# EAGLE design FSAE Charger Control Board rev3 (EAGLE 9.0.1)
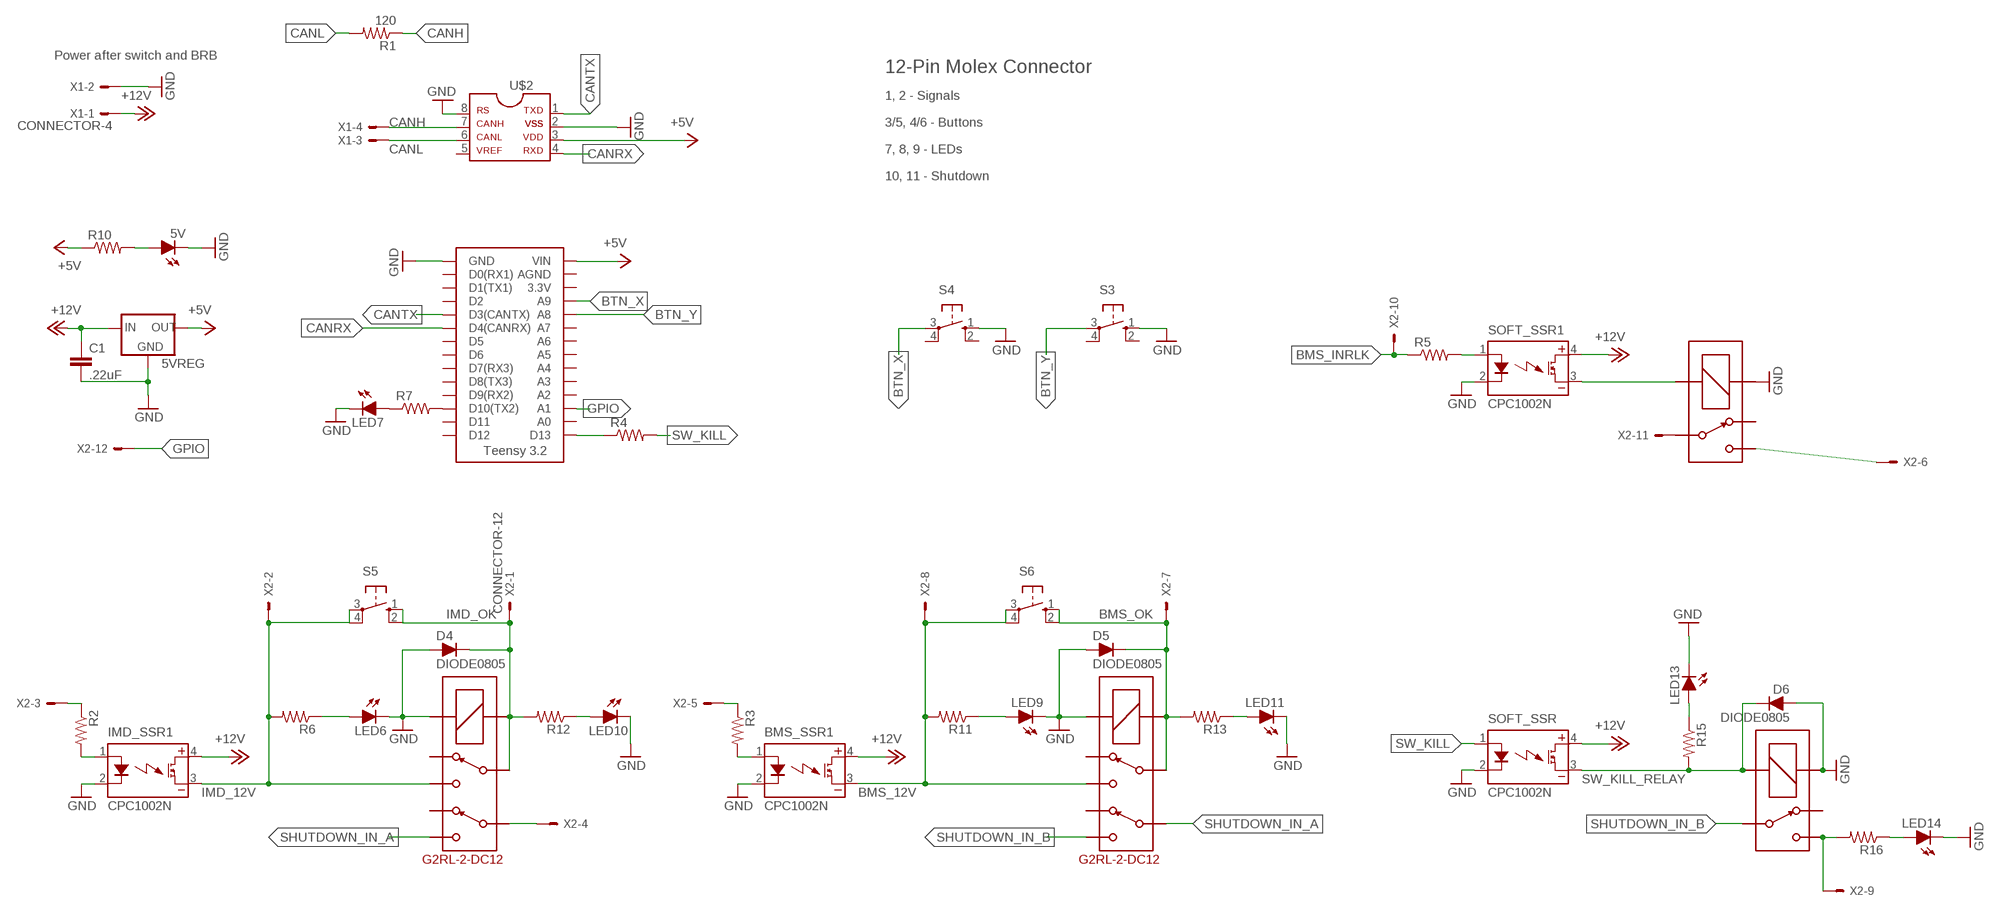
[diagram p0: schematic, sheet 1]

## Parts
5V  LED-0805  [LED-805]
5VREG  5VREG_LM340-NLM340MPX-5.0/NOPB  [SOT223]
BMS_SSR1  CPC1002N  [SOP04]
C1  .22uF  CAP0805  [0805]
D4  DIODE0805  [0805_D]
D5  DIODE0805  [0805_D]
D6  DIODE0805  [0805_D]
IMD_SSR1  CPC1002N  [SOP04]
LED6  LED-0805  [LED-805]
LED7  LED-0805  [LED-805]
LED9  LED-0805  [LED-805]
LED10  LED-0805  [LED-805]
LED11  LED-0805  [LED-805]
LED13  LED-0805  [LED-805]
LED14  LED-0805  [LED-805]
R1  120  RESISTOR0805-RES  [0805]
R2  RESISTOR0805-RES  [0805]
R3  RESISTOR0805-RES  [0805]
R4  RESISTOR0805-RES  [0805]
R5  RESISTOR0805-RES  [0805]
R6  RESISTOR0805-RES  [0805]
R7  RESISTOR0805-RES  [0805]
R10  RESISTOR0805-RES  [0805]
R11  RESISTOR0805-RES  [0805]
R12  RESISTOR0805-RES  [0805]
R13  RESISTOR0805-RES  [0805]
R15  RESISTOR0805-RES  [0805]
R16  RESISTOR0805-RES  [0805]
S3  BTN_10-XX  [B3F-10XX]
S4  BTN_10-XX  [B3F-10XX]
S5  BTN_10-XX  [B3F-10XX]
S6  BTN_10-XX  [B3F-10XX]
SOFT_SSR  CPC1002N  [SOP04]
SOFT_SSR1  CPC1002N  [SOP04]
U$1  TEENSY_3.2_SIMPLE  [TEENSY_3.2_SIMPLE]
U$2  MCP2551  [SOIC-08]
U$3  G5LE  [ZF112]
U$6  G2RL-2-DC12  [G2RL-2]
U$7  G2RL-2-DC12  [G2RL-2]
U$8  G5LE  [ZF112]
X1  CONNECTOR-4  [MINIFIT_5566-4]
X2  CONNECTOR-12  [MINIFIT_5566-12]

## Nets
+5V: 5VREG.3(OUT) R10.1 U$1.VIN U$2.3
+12V: 5VREG.1(IN) BMS_SSR1.4(DC+) C1.1 IMD_SSR1.4(DC+) SOFT_SSR1.4(DC+) SOFT_SSR.4(DC+) X1.1
BMS_12V: BMS_SSR1.3(DC-) R11.2 S6.3(P) S6.4(P1) U$7.4 X2.8
BMS_INRLK: R5.1 X2.10
BMS_OK: D5.C R13.2 S6.1(S) S6.2(S1) U$7.3 U$7.COIL- X2.7
BTN_X: S4.3(P) U$1.A9
BTN_Y: S3.3(P) U$1.A8
CANH: R1.1 U$2.7 X1.4
CANL: R1.2 U$2.6 X1.3
CANRX: U$1.D4(CANRX) U$2.4
CANTX: U$1.D3(CANTX) U$2.1
GND: 5V.C 5VREG.2(GND) 5VREG.4(GND) BMS_SSR1.2(CONTROL-) C1.2 D4.A D5.A D6.A IMD_SSR1.2(CONTROL-) LED6.C LED7.C LED9.C LED10.C LED11.C LED13.C LED14.C S3.1(S) S4.1(S) SOFT_SSR1.2(CONTROL-) SOFT_SSR.2(CONTROL-) U$1.GND U$2.2 U$2.8 U$3.1(COIL+) U$6.COIL+ U$7.COIL+ U$8.1(COIL+) X1.2
GPIO: U$1.A1 X2.12
IMD_12V: IMD_SSR1.3(DC-) R6.2 S5.3(P) S5.4(P1) U$6.4 X2.2
IMD_OK: D4.C R12.2 S5.1(S) S5.2(S1) U$6.3 U$6.COIL- X2.1
N$1: SOFT_SSR1.3(DC-) U$3.2(COIL-)
N$2: LED7.A R7.1
N$3: 5V.A R10.2
N$4: IMD_SSR1.1(CONTROL+) R2.2
N$5: U$3.S X2.6
N$6: LED6.A R6.1
N$7: LED9.A R11.1
N$8: LED10.A R12.1
N$9: U$3.P X2.11
N$10: R7.2 U$1.D10(TX2)
N$11: BMS_SSR1.1(CONTROL+) R3.2
N$12: LED11.A R13.1
N$13: LED14.A R16.1
N$14: LED13.A R15.1
N$15: R2.1 X2.3
N$16: R3.1 X2.5
N$17: R5.2 SOFT_SSR1.1(CONTROL+)
N$18: R4.1 U$1.D13
SHUTDOWN_IN: U$6.6 X2.4
SHUTDOWN_IN_A: U$6.5 U$7.6
SHUTDOWN_IN_B: U$7.5 U$8.P
SHUTDOWN_OUT: R16.2 U$8.S X2.9
SW_KILL: R4.2 SOFT_SSR.1(CONTROL+)
SW_KILL_RELAY: D6.C R15.2 SOFT_SSR.3(DC-) U$8.2(COIL-)
Unconnected: S3.2(S1) S3.4(P1) S4.2(S1) S4.4(P1) U$1.3.3V U$1.A0 U$1.A2 U$1.A3 U$1.A4 U$1.A5 U$1.A6 U$1.A7 U$1.AGND U$1.D0(RX1) U$1.D1(TX1) U$1.D2 U$1.D5 U$1.D6 U$1.D7(RX3) U$1.D8(TX3) U$1.D9(RX2) U$1.D11 U$1.D12 U$2.5 U$3.O U$6.2 U$6.7 U$7.2 U$7.7 U$8.O

## Notes on the sheet
- Power after switch and BRB
- 12-Pin Molex Connector
- 1, 2 - Signals
- 3/5, 4/6 - Buttons
- 7, 8, 9 - LEDs
- 10, 11 - Shutdown

## Library data of the parts
5V LED6 LED7 LED9-LED11 LED13 LED14 = HyTechDevices:LED: Light Emitting Diode (LED) Source: Dangerous Prototypes Eagle Library <https://github.com/DangerousPrototypes/Eagle_Part_Library>
5VREG = HyTechDevices:5VREG_LM340-N: Voltage Regulator 5v linear voltage regulator Datasheet <http://www.mouser.com/ProductDetail/Texas-Instruments/LM340MPX-50-NOPB/?qs=X1J7HmVL2ZGZwtTFRQ9ItA%3D%3D> MAX current out: 1.5A MAX voltage in: 35V
BMS_SSR1 IMD_SSR1 SOFT_SSR SOFT_SSR1 = HyTechDevices:CPC1002N: IXYS Solid State Relay .7A
C1 = HyTechDevices:CAP: Capacitor Standard 0603 ceramic capacitor, and 0.1" leaded capacitor.
D4-D6 = HyTechDevices:DIODE: DIODE general purpose rectifier
R1-R7 R10-R13 R15 R16 = HyTechDevices:RESISTOR: Resistor Basic schematic elements and footprints for 0603, 1206, and PTH resistors.
S3-S6 = HyTechDevices:BTN_10-XX: Small momentary tactile push button; MPN: B3F-1000; OC_FARNELL: 176432; OC_NEWARK: 36M3542
U$1 = HyTechDevices:TEENSY_3.2_SIMPLE: Simple version of the Teensy 3.2 board that only uses the 2 main rows of pins, not the inner pins or the pins opposite the usb port.
U$2 = HyTechDevices:MCP2551: MCP2551 High-Speed CAN Transceiver Product Webpage <https://www.microchip.com/wwwproducts/en/MCP2551> Datasheet <http://ww1.microchip.com/downloads/en/DeviceDoc/21667f.pdf> This device is outdated It is replaced by MCP2561. Comparison Page <https://www.microchip.com/wwwproducts/ProductCompare/MCP2551/MCP2561> Product Webpage <https://www.microchip.com/wwwproducts/en/MCP2561> Datasheet <http://ww1.microchip.com/downloads/en/DeviceDoc/20005167C.pdf>
U$3 U$8 = HyTechDevices:G5LE: Omron G5LE SPST Relay 5 VDC, 12VDC, 24VDC models Coil voltage: 75% - 170% of nominal voltage Datasheet <https://www.omron.com/ecb/products/pdf/en-g5le.pdf>
U$6 U$7 = HyTechDevices:G2RL-2-DC12: Omron G2RL-2 Double Pull Double Throw Relay Coil Voltage: 12VDC (8.4-18VDC @60ºC) Contact Amperage: 8A at 30VDC Datasheet <https://www.omron.com/ecb/products/pdf/en-g2rl.pdf>
X1 = HyTechDevices:CONNECTOR-4: Mini-Fit Junior connector 4 pole Source: http://www.molex.com; OC_FARNELL: unknown; OC_NEWARK: unknown
X2 = HyTechDevices:CONNECTOR-12: Mini-Fit Junior connector 12 pole Source: http://www.molex.com; OC_FARNELL: unknown; OC_NEWARK: unknown

## Board
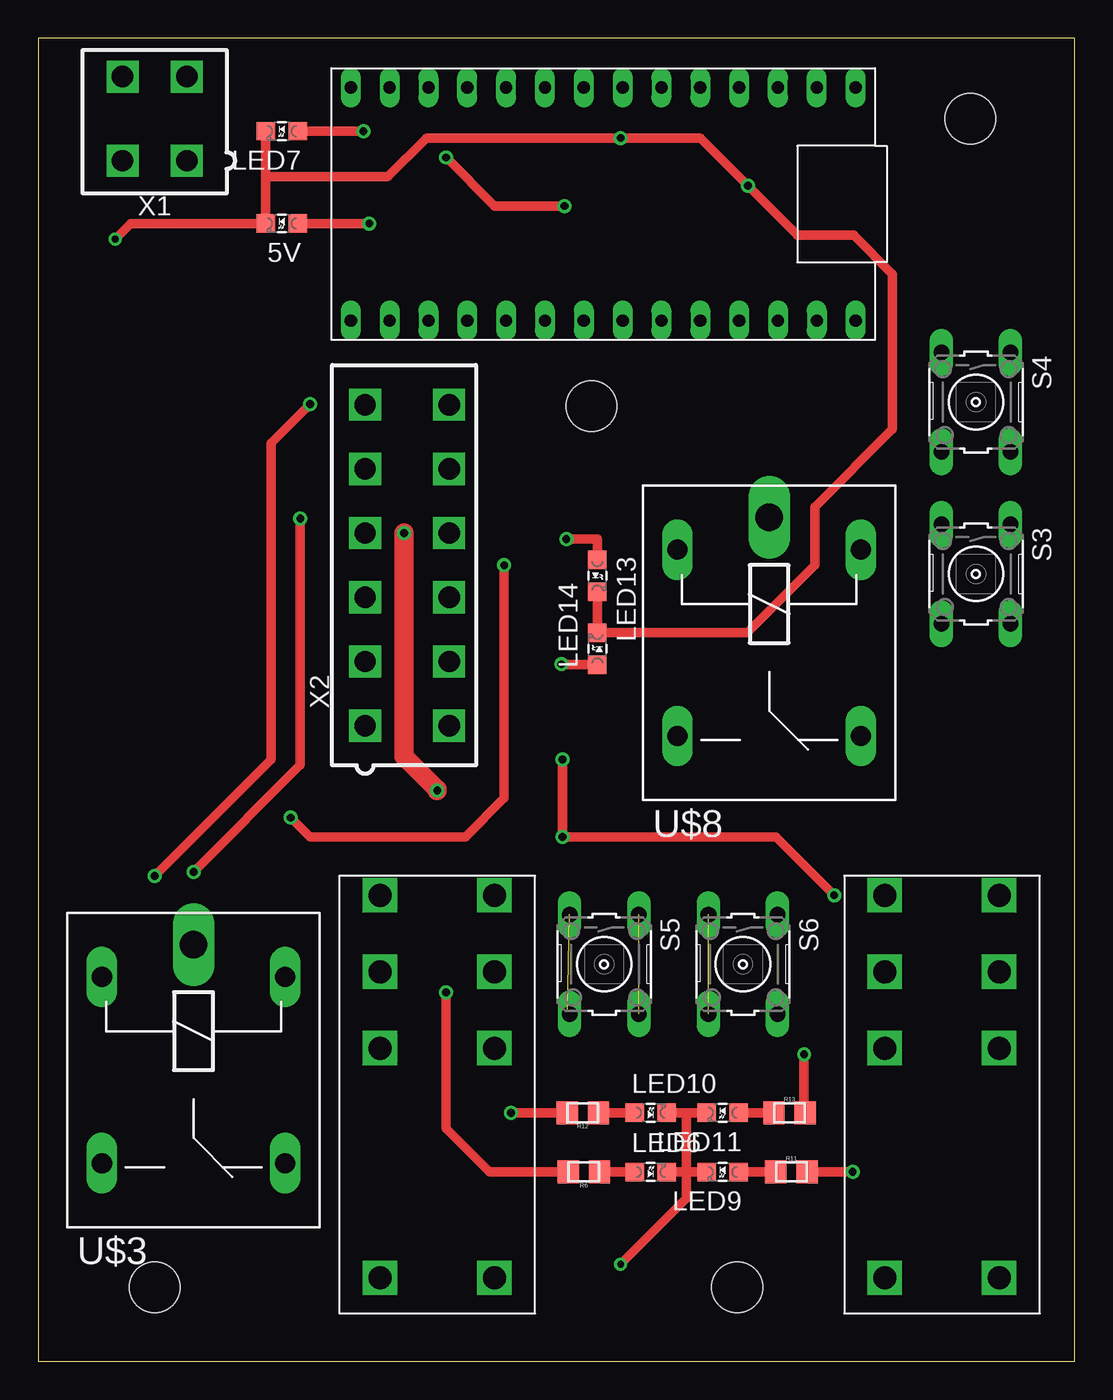
[diagram p1: board, top side]
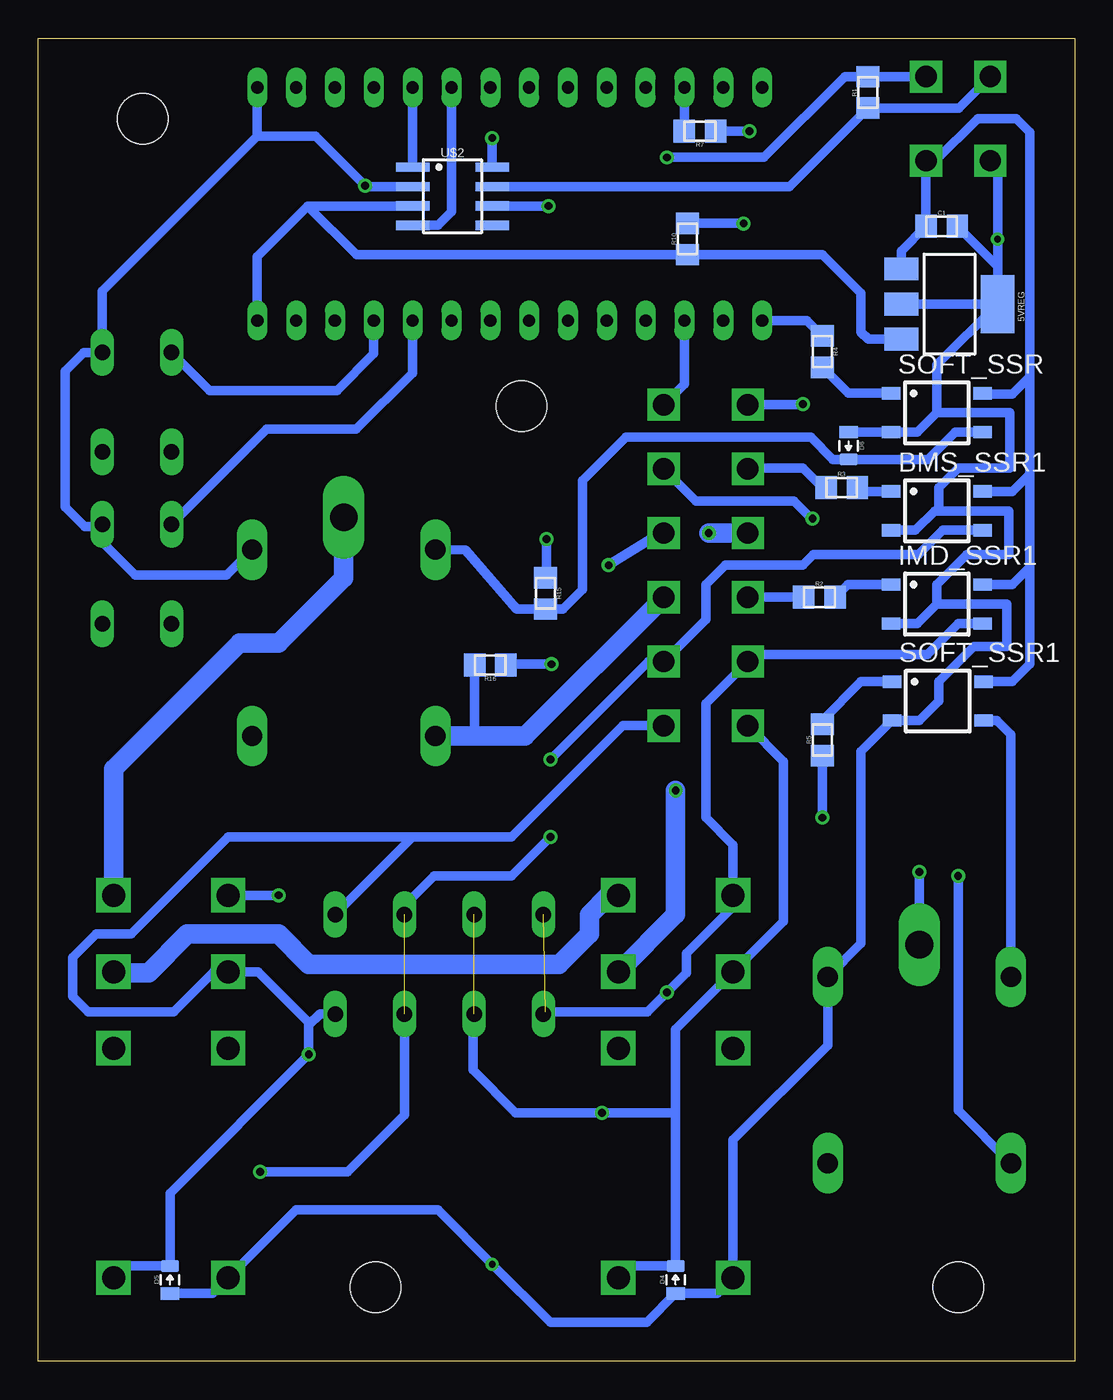
[diagram p2: board, bottom side, seen from below]

Size 67.8 x 86.54 mm. Coordinates in mm from the lower left corner, seen from the top.
Outline: 0,0 67.8,0 67.8,86.54 0,86.54 0,0
Copper layers (1*16): Top 0.035mm / dielectric 1.5mm / Bottom 0.035mm
Design rules "DRC Advanced Circuits": minimum track width 6mil, minimum drill 15mil, track to track 6mil, track to pad 6mil, pad to pad 6mil, via to via 6mil, smd to smd 6mil, copper to edge 40mil, drill to drill 6mil, minimum pad ring 10mil, minimum via ring 8mil, stop-mask expansion 4mil, vias tented up to drill 0mil, thermal gap 10mil
Holes 3.3 mm at 7.62,4.83 60.96,81.28 45.72,4.83 36.2,62.48

### Footprints (pad centres in the part's own frame; a part is rotated, then mirrored left to right if it is on the bottom)
LED-805 = smd 1.2 x 1.2: A 0,-1.05; C 0,1.05
SOT223 = smd 1.5 x 2.235: 1 -2.3,-3.15; 2 0,-3.15; 3 2.3,-3.15 | smd 3.8 x 2.2: 4 0,3.15
SOP04 = smd 0.8 x 1.2: 1 -1.27,-3; 2 1.27,-3; 3 1.27,3; 4 -1.27,3
0805 = smd 1.4 x 1.5: 1 -1.025,0; 2 1.025,0
0805_D = smd 0.8 x 1.2: A -0.9,0; C 0.9,0
B3F-10XX = drill 1.016 long: 1 -3.251,2.261; 2 3.251,2.261; 3 -3.251,-2.261; 4 3.251,-2.261
TEENSY_3.2_SIMPLE = drill 0.8 long: 3.3V 16.51,29.21; A0 16.51,3.81; A1 16.51,6.35; A2 16.51,8.89; A3 16.51,11.43; A4 16.51,13.97; A5 16.51,16.51; A6 16.51,19.05; A7 16.51,21.59; A8 16.51,24.13; A9 16.51,26.67; AGND 16.51,31.75; D0(RX1) 1.27,31.75; D1(TX1) 1.27,29.21; D2 1.27,26.67; D3(CANTX) 1.27,24.13; D4(CANRX) 1.27,21.59; D5 1.27,19.05; D6 1.27,16.51; D7(RX3) 1.27,13.97; D8(TX3) 1.27,11.43; D9(RX2) 1.27,8.89; D10(TX2) 1.27,6.35; D11 1.27,3.81; D12 1.27,1.27; D13 16.51,1.27; GND 1.27,34.29; VIN 16.51,34.29
SOIC-08 = smd 0.6 x 2.2: 1 -1.905,-2.6; 2 -0.635,-2.6; 3 0.635,-2.6; 4 1.905,-2.6; 5 1.905,2.6; 6 0.635,2.6; 7 -0.635,2.6; 8 -1.905,2.6
ZF112 = drill 1.321 long: 1 4.064,14.884; 2 4.064,2.896; O 16.256,14.884; S 16.256,2.896 | drill 1.803 long: P 1.956,8.89
G2RL-2 = drill 1.5 square: 2 10.008,0; 3 5.004,0; 4 0,0; 5 0,7.493; 6 5.004,7.493; 7 10.008,7.493; COIL+ 25.019,0; COIL- 25.019,7.493
MINIFIT_5566-4 = drill 1.4 square: 1 2.1,-2.75; 2 -2.1,-2.75; 3 2.1,2.75; 4 -2.1,2.75
MINIFIT_5566-12 = drill 1.4 square: 1 10.5,-2.75; 2 6.3,-2.75; 3 2.1,-2.75; 4 -2.1,-2.75; 5 -6.3,-2.75; 6 -10.5,-2.75; 7 10.5,2.75; 8 6.3,2.75; 9 2.1,2.75; 10 -2.1,2.75; 11 -6.3,2.75; 12 -10.5,2.75

### Placement (x,y rotation side)
5V  15.94,74.42 90 top
5VREG  8.19,69.15 270 bottom
BMS_SSR1  9.02,55.63 270 bottom
C1  8.7,74.23 0 bottom
D4  26.1,5.33 90 bottom
D5  59.18,5.33 90 bottom
D6  14.8,59.88 270 bottom
IMD_SSR1  9.02,49.53 270 bottom
LED6  40.07,12.38 270 top
LED7  15.94,80.45 90 top
LED9  44.77,12.38 90 top
LED10  40.07,16.26 270 top
LED11  44.77,16.26 90 top
LED13  36.58,51.37 180 top
LED14  36.58,46.61 0 top
R1  13.53,82.99 90 bottom
R2  16.7,49.97 0 bottom
R3  15.24,57.15 0 bottom
R4  16.51,66.04 270 bottom
R5  16.51,40.64 90 bottom
R6  35.69,12.38 180 top
R7  24.51,80.45 180 bottom
R10  25.34,73.41 90 bottom
R11  49.28,12.38 0 top
R12  35.62,16.26 180 top
R13  49.15,16.26 0 top
R15  34.61,50.23 270 bottom
R16  38.23,45.53 180 bottom
S3  61.34,51.5 270 top
S4  61.34,62.74 270 top
S5  37.02,25.97 270 top
S6  46.1,25.97 270 top
SOFT_SSR  9.02,62.04 270 bottom
SOFT_SSR1  8.95,43.18 270 bottom
U$1  19.18,84.58 270 top
U$2  40.7,76.2 270 bottom
U$3  1.27,29.21 270 top
U$6  22.35,30.48 270 top
U$7  55.37,30.48 270 top
U$8  38.93,57.15 270 top
X1  7.62,81.28 0 top
X2  24.13,52.07 270 top

### Tracks (layer width: path | path; a pad name or v marks a point on that pad's centre or on a via)
+5V
  Bottom 0.61: 50.16,75.56 U$2.3 | U$1.VIN 53.47,70.1 53.47,72.26 50.16,75.56 | 50.16,75.56 46.98,72.38 R10.1 25.33,72.39 16.51,72.39 13.97,69.85 13.97,67.31 13.51,66.85 5VREG.3
+12V
  Bottom 0.61: SOFT_SSR.4 5.96,63.26 4.06,63.26 2.92,64.4 | 5VREG.1 11.34,72.61 C1.1 X1.1 9.1,78.53 6.35,81.28 3.81,81.28 2.92,80.39 2.92,64.4 | 2.92,64.4 2.92,58.04 | 2.92,58.04 4.06,56.9 BMS_SSR1.4 | 2.92,58.04 2.92,51.94 | 2.92,51.94 4.06,50.8 IMD_SSR1.4 | 2.92,51.94 2.92,45.59 4.06,44.45 SOFT_SSR1.4
BMS_12V  (via drill 0.51)  (1 unrouted)
  Top 0.61: v53.28,12.38 R11.2 | v34.29,39.37 v34.29,34.29 48.26,34.29 v52.07,30.48
  Bottom 0.61: BMS_SSR1.3 8.64,54.36 10.22,52.77 17.08,52.77 17.78,52.07 22.86,52.07 24.13,50.8 24.13,48.52 X2.8 27.89,45.77 v34.29,39.37 | S6.4 43.84,16.1 47.56,12.38 v53.28,12.38 | S6.3 43.84,29.82 41.91,31.75 36.83,31.75 v34.29,34.29 | U$7.4 v52.07,30.48
BMS_INRLK  (via drill 0.51)
  Top 0.61: v16.51,35.56 17.78,34.29 27.94,34.29 30.48,36.83 v30.48,52.07
  Bottom 0.61: v30.48,52.07 27.11,54.17 X2.10 | R5.1 v16.51,35.56
BMS_OK  (via drill 0.51)
  Top 0.61: v50.1,20.07 50.1,16.26 R13.2
  Bottom 0.61: U$7.COIL- 62.09,6.23 D5.C 59.18,10.99 v50.1,20.07 50.1,21.99 | 50.1,21.99 50.1,22.16 53.42,25.48 U$7.3 56.31,25.48 58.93,22.86 64.52,22.86 65.53,23.88 65.53,26.42 64.01,27.94 61.72,27.94 55.37,34.29 43.29,34.29 | S6.2 49.37,22.72 50.1,21.99 | X2.7 29.55,41.57 36.83,34.29 43.29,34.29 | 43.29,34.29 S6.1 48.36,29.31
BTN_X
  Bottom 0.61: U$1.A9 45.85,65.91 48.26,63.5 56.59,63.5 S4.3
BTN_Y
  Bottom 0.61: S3.3 52.87,60.96 46.99,60.96 43.31,64.64 U$1.A8
CANH
  Bottom 0.61: X1.4 7.58,81.97 R1.1 18.66,76.83 U$2.7
CANL  (via drill 0.51)
  Top 0.61: v34.42,75.56 29.84,75.56 v26.67,78.74
  Bottom 0.61: X1.3 R1.2 15.04,84.02 20.32,78.74 v26.67,78.74 | U$2.6 v34.42,75.56
CANRX
  Bottom 0.61: U$1.D4(CANRX) 40.77,75.18 41.66,74.3 U$2.4
CANTX
  Bottom 0.61: U$2.1 U$1.D3(CANTX)
GND  (via drill 0.45, 0.51)
  Top 0.61: LED9.C 42.42,12.38 | LED10.C 42.42,16.26 | 42.42,16.26 LED11.C | 42.42,16.26 42.42,12.38 | LED6.C 42.42,12.38 | v46.42,76.9 43.31,80.01 v38.1,80.01 25.4,80.01 22.86,77.47 14.89,77.47 | v46.42,76.9 46.48,76.83 | LED7.C 14.89,77.47 | 14.89,77.47 5V.C 6.06,74.42 v5.04,73.41 | v46.42,76.9 49.66,73.66 53.34,73.66 55.88,71.12 55.88,60.96 50.8,55.88 50.8,52.07 46.39,47.66 LED14.C LED13.C | 42.42,12.38 42.42,10.67 v38.1,6.35
  Bottom 0.61: D5.A 56.4,4.43 U$7.COIL+ 50.93,9.91 41.66,9.91 v38.1,6.35 34.29,2.54 27.99,2.54 D4.A 23.38,4.43 U$6.COIL+ 22.35,14.48 16.15,20.68 U$3.1 13.97,27.33 13.97,39.89 SOFT_SSR1.2 10.16,41.91 8.89,43.18 8.89,44.45 6.6,46.74 4.45,46.74 4.45,49.53 9.02,49.53 | 5.55,78.5 X1.2 5.04,78.05 v5.04,73.41 5.04,71.63 | 7.61,74.17 C1.2 5.07,71.63 5.04,71.63 | U$2.8 38.1,78.74 v38.1,80.01 | U$2.2 46.35,76.83 v46.42,76.9 49.66,80.14 53.47,80.14 | 8.89,55.63 4.32,55.63 4.32,52.77 7.05,52.77 9.02,50.8 9.02,49.53 | 9.02,49.53 10.29,48.26 IMD_SSR1.2 | 8.89,55.63 9.14,55.63 10.41,54.36 BMS_SSR1.2 | 8.89,55.63 8.89,57.15 7.62,58.42 4.25,58.42 4.25,62.04 9.02,62.04 | 9.02,62.04 10.29,60.77 SOFT_SSR.2 D6.A | U$1.GND 53.47,80.14 | 5VREG.4 5.04,71.63 | 9.02,62.04 9.02,65.18 5VREG.4 | 5VREG.2 5VREG.4 | 53.47,80.14 63.6,70 S4.1 64.82,65.99 66.04,64.77 66.04,55.88 64.77,54.61 63.74,54.61 S3.1 63.6,53.57 61.47,51.44 55.46,51.44 U$8.1
GPIO
  Bottom 0.61: U$1.A1 25.53,63.92 X2.12
IMD_12V  (via drill 0.51)  (1 unrouted)
  Top 0.61: R6.2 29.53,12.38 26.67,15.24 v26.67,24.13
  Bottom 0.61: IMD_SSR1.3 7.62,48.26 9.65,46.23 20.92,46.23 X2.2 24.13,43.02 24.13,35.56 22.35,33.78 U$6.4 22.35,29.72 25.4,26.67 25.4,25.4 v26.67,24.13 27.94,22.86 34.62,22.86 arc-90 S5.4
IMD_OK  (via drill 0.51)  (1 unrouted)
  Top 0.61: v30.92,16.26 R12.2
  Bottom 0.61: 26.11,16.26 D4.C 29.07,6.23 U$6.COIL- | 26.11,16.26 v30.92,16.26 36.58,16.26 39.37,19.05 39.37,22.63 S5.2 | 26.11,16.26 26.11,21.72 U$6.3 19.05,28.78 19.05,39.24 X2.1
N$1
  Bottom 0.61: U$3.2 4.17,41 5.08,41.91 SOFT_SSR1.3
N$2  (via drill 0.51)
  Top 0.61: v21.27,80.45 LED7.A
  Bottom 0.61: R7.1 v21.27,80.45
N$3  (via drill 0.51)
  Top 0.61: v21.65,74.42 5V.A
  Bottom 0.61: R10.2 21.66,74.43 v21.65,74.42
N$4
  Bottom 0.61: IMD_SSR1.1 14.85,50.8 R2.2
N$5  (via drill 0.51)
  Top 0.61: v7.62,31.75 15.24,39.37 15.24,60.07 v17.78,62.61
  Bottom 0.61: X2.6 17.82,62.57 v17.78,62.61 | U$3.S 7.62,16.41 v7.62,31.75
N$6
  Top 0.61: R6.1 LED6.A
N$7
  Top 0.61: LED9.A R11.1
N$8
  Top 0.61: R12.1 LED10.A
N$9  (via drill 0.51)
  Top 0.61: v17.14,55.12 17.14,38.99 v10.16,32
  Bottom 0.61: X2.11 24.77,56.26 18.35,56.26 17.21,55.12 v17.14,55.12 | v10.16,32 U$3.P
N$10
  Bottom 0.61: R7.2 U$1.D10(TX2)
N$11
  Bottom 0.61: BMS_SSR1.1 13.96,56.9 R3.2
N$12
  Top 0.61: R13.1 LED11.A
N$13  (via drill 0.51)
  Top 0.61: v34.23,45.59 34.19,45.56 LED14.A
  Bottom 0.61: R16.1 37.14,45.59 v34.23,45.59
N$14  (via drill 0.51)
  Top 0.61: 34.57,53.81 v34.54,53.78 36.58,53.78 LED13.A
  Bottom 0.61: v34.54,53.78 34.54,51.32 R15.1
N$15
  Bottom 0.61: R2.1 X2.3
N$16
  Bottom 0.61: R3.1 16.51,57.15 17.78,58.42 21.33,58.42 X2.5
N$17
  Bottom 0.61: SOFT_SSR1.1 13.97,44.45 16.51,41.91 R5.2
N$18
  Bottom 0.61: R4.1 17.52,68.07 U$1.D13
SHUTDOWN_IN  (via drill 0.51)
  Top 1.27: v23.94,54.17 23.94,39.56 26.1,37.4 v26.1,37.34
  Bottom 1.27: X2.4 v23.94,54.17 | v26.1,37.34 26.1,29.22 U$6.6
SHUTDOWN_IN_A
  Bottom 1.27: U$7.6 62.79,25.4 60.58,25.4 58.04,27.94 52.07,27.94 50.1,25.97 33.72,25.97 31.75,27.94 31.75,29.21 30.48,30.48 U$6.5
SHUTDOWN_IN_B
  Bottom 1.27: U$8.P 47.82,51.24 52.07,46.99 54.61,46.99 62.87,38.73 U$7.5
SHUTDOWN_OUT
  Bottom 0.61: U$8.S 39.25,40.92 R16.2
  Bottom 1.27: U$8.S 35.96,40.89 X2.9
SW_KILL
  Bottom 0.61: SOFT_SSR.1 14.8,63.31 R4.2
SW_KILL_RELAY
  Bottom 0.61: SOFT_SSR.3 7.81,60.77 9.6,58.98 D6.C 15.8,58.98 17.26,60.44 | U$8.2 39.85,53.06 36.5,49.2 R15.2 33.47,49.2 32.19,50.48 32.19,57.59 29.34,60.45 17.27,60.45 | 17.26,60.44 17.27,60.45 | 17.27,60.45 17.26,60.44

### Text on the board
tDocu: GPIO | 5V | SWKILL | fsae_charger_control_board_rev3 / Designed by Chad Hendrix | SDOUT | IMD Relay | BMS Relay | IMD | BMS | BMSR | IMDR | IMD12 | BMS12